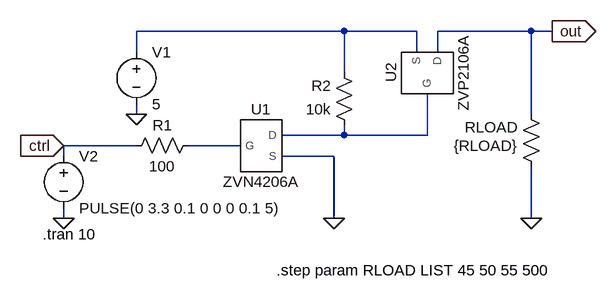
[diagram p0: schematic sensor_pwr_w_param.asc]
sensor_pwr_w_param.asc, the LTspice schematic file:
Version 4
SHEET 1 976 680
WIRE 192 0 -128 0
WIRE 304 0 192 0
WIRE 480 0 336 0
WIRE 512 0 480 0
WIRE -128 32 -128 0
WIRE 304 32 304 0
WIRE 336 32 336 0
WIRE 192 64 192 0
WIRE -128 128 -128 112
WIRE 480 128 480 0
WIRE 192 160 192 144
WIRE 192 160 96 160
WIRE 320 160 320 96
WIRE 320 160 192 160
WIRE -128 176 -240 176
WIRE 32 176 -48 176
WIRE -240 192 -240 176
WIRE 176 192 96 192
WIRE -240 288 -240 272
WIRE 176 288 176 192
WIRE 480 288 480 208
FLAG 176 288 0
FLAG 480 288 0
FLAG -128 128 0
FLAG -240 288 0
FLAG -240 176 ctrl
IOPIN -240 176 In
FLAG 512 0 out
IOPIN 512 0 Out
SYMBOL AutoGenerated\\ZVN4206A 64 176 R0
SYMATTR InstName U1
SYMBOL AutoGenerated\\ZVP2106A 320 64 R270
SYMATTR InstName U2
SYMBOL res -32 160 R90
WINDOW 0 0 56 VBottom 2
WINDOW 3 32 56 VTop 2
SYMATTR InstName R1
SYMATTR Value 100
SYMBOL res 208 160 R180
WINDOW 0 36 76 Left 2
WINDOW 3 36 40 Left 2
SYMATTR InstName R2
SYMATTR Value 10k
SYMBOL res 496 224 R180
WINDOW 0 36 76 Left 2
WINDOW 3 36 48 Left 2
SYMATTR InstName RLOAD
SYMATTR Value {RLOAD}
SYMBOL voltage -128 16 R0
WINDOW 123 0 0 Left 0
WINDOW 39 0 0 Left 0
SYMATTR InstName V1
SYMATTR Value 5
SYMBOL voltage -240 176 R0
WINDOW 123 0 0 Left 0
WINDOW 39 0 0 Left 0
SYMATTR InstName V2
SYMATTR Value PULSE(0 3.3 0.1 0 0 0 0.1 5)
TEXT -272 312 Left 2 !.tran 10
TEXT 88 368 Left 2 !.step param RLOAD LIST 45 50 55 500

The netlist it stands for:
* sensor_pwr_w_param.asc
XU1 N002 N003 0 ZVN4206A  ; pins D G S
XU2 out N002 N001 ZVP2106A  ; pins D G S
R1 N003 ctrl 100
R2 N002 N001 10k
RLOAD 0 out {RLOAD}
V1 N001 0 5
V2 ctrl 0 PULSE(0 3.3 0.1 0 0 0 0.1 5)
.tran 10
.step param RLOAD LIST 45 50 55 500
.lib C:\Users\mp\Desktop\ZVN4206A.net
.lib C:\Users\mp\Desktop\ZVP2106A.net
.backanno
.end